# EAGLE design 491 Circuit Schematic to MILL mixed 4th (EAGLE 6.3)
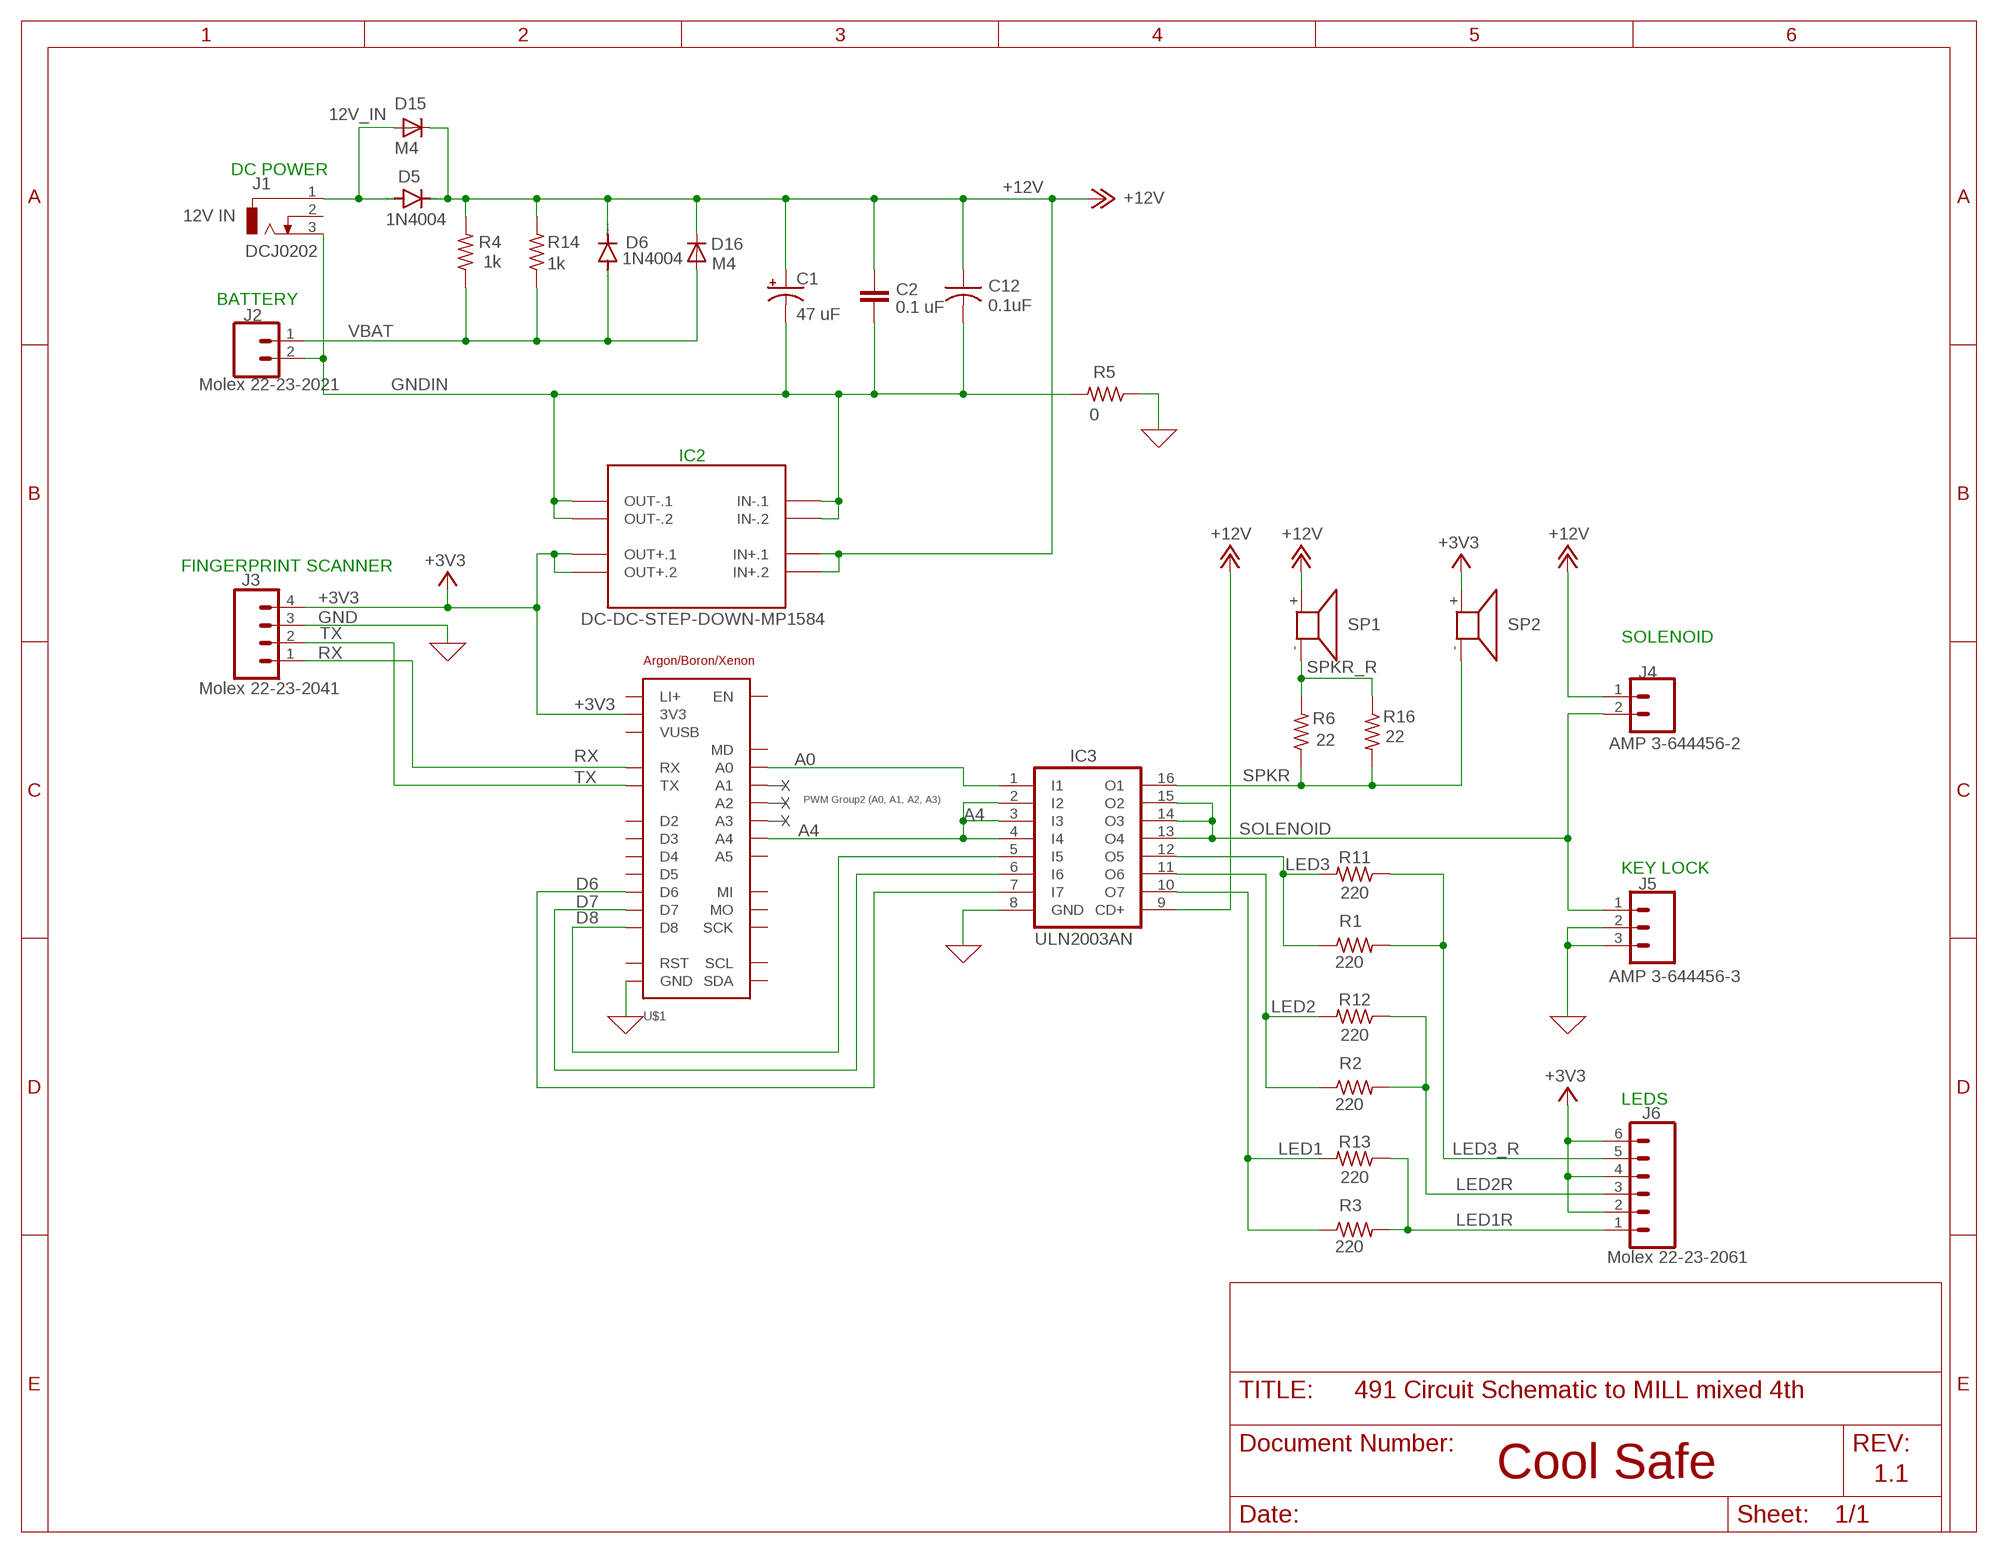
[diagram p0: schematic, sheet 1]

## Parts
C1  47 uF  CPOL-USE2.5-6  [E2,5-6]
C2  0.1 uF  C2.5/5  [C2.5-5]
C12  0.1uF  C-USC1206  [C1206]
D5  1N4004  [DO41-10]
D6  1N4004  [DO41-10]
D15  M4  GF1  [SMA-DO214AC]
D16  M4  GF1  [SMA-DO214AC]
IC2  DC-DC-STEP-DOWN-MP1584  [DC-DC-STEP-DOWN-MP1584]
IC3  ULN2003AN  [DIL16]
J1  DCJ0202  [DCJ0202]
J2  Molex 22-23-2021  CONN_02POLAR  [MOLEX-1X2]
J3  Molex 22-23-2041  CONN_04POLAR  [MOLEX-1X4]
J4  AMP 3-644456-2  CONN_02  [1X02]
J5  AMP 3-644456-3  CONN_03  [1X03]
J6  Molex 22-23-2061  CONN_06POLAR  [MOLEX-1X6]
R1  220  R-US_0207/10  [0207/10]
R2  220  R-US_0207/10  [0207/10]
R3  220  R-US_0207/10  [0207/10]
R4  1k  R-US_0207/10  [0207/10]
R5  0  R-US_0207/10  [0207/10]
R6  22  R-US_0204/7  [0204/7]
R11  220  R-US_M1206  [M1206]
R12  220  R-US_M1206  [M1206]
R13  220  R-US_M1206  [M1206]
R14  1k  R-US_M1206  [M1206]
R16  22  R-US_M1206  [M1206]
SP1  KSS1201  [KSS1201]
SP2  KSS1201  [KSS1201]
U$1  TEMPLATE_ARGON/BORON/XENONPTH  [NO_PADS]

## Nets
12V_IN: D5.A D15.A J1.1
+3V3: IC2.OUT+.1 IC2.OUT+.2 J3.4 J6.2 J6.4 J6.6 SP2.+ U$1.P$14(3V3)
+12V: C1.+ C2.1 C12.1 D5.C D6.C D15.K(C) D16.K(C) IC2.IN+.1 IC2.IN+.2 IC3.9(CD+) J4.1 R4.2 R14.2 SP1.+
A0: IC3.1(I1) U$1.P$17(A0)
A4: IC3.2(I2) IC3.3(I3) IC3.4(I4) U$1.P$21(A4)
D6: IC3.7(I7) U$1.P$6(D6)
D7: IC3.6(I6) U$1.P$5(D7)
D8: IC3.5(I5) U$1.P$4(D8)
GND: IC3.8(GND) J3.3 J5.2 J5.3 R5.1 U$1.P$16(GND)
GNDIN: C1.- C2.2 C12.2 IC2.IN-.1 IC2.IN-.2 IC2.OUT-.1 IC2.OUT-.2 J1.3 J2.2 R5.2
LED1: IC3.10(O7) R3.1 R13.2
LED1R: J6.1 R3.2 R13.1
LED2: IC3.11(O6) R2.1 R12.2
LED2R: J6.3 R2.2 R12.1
LED3: IC3.12(O5) R1.1 R11.2
LED3_R: J6.5 R1.2 R11.1
RX: J3.1 U$1.P$26(RX)
SOLENOID: IC3.13(O4) IC3.14(O3) IC3.15(O2) J4.2 J5.1
SPKR: IC3.16(O1) R6.1 R16.2 SP2.-
SPKR_R: R6.2 R16.1 SP1.-
TX: J3.2 U$1.P$27(TX)
VBAT: D6.A D16.A J2.1 R4.1 R14.1
Unconnected: J1.2 U$1.P$1(LI+) U$1.P$2(EN) U$1.P$3(VUSB) U$1.P$7(D5) U$1.P$8(D4) U$1.P$9(D3) U$1.P$10(D2) U$1.P$11(SCL) U$1.P$12(SDA) U$1.P$13(RST) U$1.P$15(MD) U$1.P$18(A1) U$1.P$19(A2) U$1.P$20(A3) U$1.P$22(A5) U$1.P$23(SCK) U$1.P$24(MO) U$1.P$25(MI)

## Notes on the sheet
- DC POWER
- 12V IN
- BATTERY
- IC2
- FINGERPRINT SCANNER
- SOLENOID
- PWM Group2 (A0, A1, A2, A3)
- KEY LOCK
- LEDS
- Cool Safe | 1.1

## Library data of the parts
C1 = rcl:CPOL-US: POLARIZED CAPACITOR, American symbol; SPICEPREFIX: C
C2 = capacitor-wima:C: CAPACITOR naming: grid - package width
C12 = rcl:C-US: CAPACITOR, American symbol
D5 D6 = diode:1N4004: DIODE general purpose rectifier, 1 A
D15 D16 = diode:GF1: DIODE
IC2 = cool_safe_lib:DC-DC-STEP-DOWN-MP1584: DC/DC Step-Down Regulator based on MP1584 chip MP1584 datasheet available here: http://www.haoyuelectronics.com/Attachment/MP1584/MP1584.pdf Click here to find device on ebay.com <http://www.ebay.com/sch/mp1584+module>
IC3 = uln-udn:ULN2003A: DRIVER ARRAY
J1 = con-jack:DCJ0202: DC POWER JACK Source: DCJ0202.pdf; OC_FARNELL: unknown; OC_NEWARK: unknown
J2 = SparkFun-Connectors:CONN_02: Multi connection point. Often used as Generic Header-pin footprint for 0.1 inch spaced/style header connections On any of the 0.1 inch spaced packages, you can populate with these: Break Away Headers - Straight <https://www.sparkfun.com/products/116> (PRT-00116) Break Away Male Headers - Right Angle <https://www.sparkfun.com/products/553> (PRT-00553) Female Headers <https://www.sparkfun.com/products/115> (PRT-00115) Break Away Headers - Machine Pin <https://www.sparkfun.com/products/117> (PRT-00117) Break Away Female Headers - Swiss Machine Pin <https://www.sparkfun.com/products/743> (PRT-00743) For SCREWTERMINALS and SPRING TERMINALS visit here: Screw Terimnals on SparkFun.com <https://www.sparkfun.com/search/results?term=Screw+Terminals> (5mm/3.5mm/2.54mm spacing) This device is also useful as a general connection point to wire up your design to another part of your project. Our various solder wires solder well into these plated through hole pads. Hook-Up Wire - Assortment (Stranded, 22 AWG) <https://www.sparkfun.com/products/11375> (PRT-11375) Hook-Up Wire - Assortment (Solid Core, 22 AWG) <https://www.sparkfun.com/products/11367> (PRT-11367) View the entire wire category on our website here <https://www.sparkfun.com/categories/141> Special notes: Molex polarized connector foot print use with: PRT-08233 with associated crimp pins and housings. 2.54_SCREWTERM for use with PRT-10571. 3.5mm Screw Terminal footprints for PRT-08084 5mm Screw Terminal footprints for use with PRT-08432; SF_ID: PRT-09918
J3 = SparkFun-Connectors:CONN_04: Multi connection point. Often used as Generic Header-pin footprint for 0.1 inch spaced/style header connections On any of the 0.1 inch spaced packages, you can populate with these: Break Away Headers - Straight <https://www.sparkfun.com/products/116> (PRT-00116) Break Away Male Headers - Right Angle <https://www.sparkfun.com/products/553> (PRT-00553) Female Headers <https://www.sparkfun.com/products/115> (PRT-00115) Break Away Headers - Machine Pin <https://www.sparkfun.com/products/117> (PRT-00117) Break Away Female Headers - Swiss Machine Pin <https://www.sparkfun.com/products/743> (PRT-00743) For SCREWTERMINALS and SPRING TERMINALS visit here: Screw Terimnals on SparkFun.com <https://www.sparkfun.com/search/results?term=Screw+Terminals> (5mm/3.5mm/2.54mm spacing) This device is also useful as a general connection point to wire up your design to another part of your project. Our various solder wires solder well into these plated through hole pads. Hook-Up Wire - Assortment (Stranded, 22 AWG) <https://www.sparkfun.com/products/11375> (PRT-11375) Hook-Up Wire - Assortment (Solid Core, 22 AWG) <https://www.sparkfun.com/products/11367> (PRT-11367) View the entire wire category on our website here <https://www.sparkfun.com/categories/141> Special notes: Molex polarized connector foot print use with SKU : PRT-08231 with associated crimp pins and housings. 1MM SMD Version SKU: PRT-10208; PROD_ID: CONN-08186; SF_ID: PRT-08231
J4 = SparkFun-Connectors:CONN_02: Multi connection point. Often used as Generic Header-pin footprint for 0.1 inch spaced/style header connections On any of the 0.1 inch spaced packages, you can populate with these: Break Away Headers - Straight <https://www.sparkfun.com/products/116> (PRT-00116) Break Away Male Headers - Right Angle <https://www.sparkfun.com/products/553> (PRT-00553) Female Headers <https://www.sparkfun.com/products/115> (PRT-00115) Break Away Headers - Machine Pin <https://www.sparkfun.com/products/117> (PRT-00117) Break Away Female Headers - Swiss Machine Pin <https://www.sparkfun.com/products/743> (PRT-00743) For SCREWTERMINALS and SPRING TERMINALS visit here: Screw Terimnals on SparkFun.com <https://www.sparkfun.com/search/results?term=Screw+Terminals> (5mm/3.5mm/2.54mm spacing) This device is also useful as a general connection point to wire up your design to another part of your project. Our various solder wires solder well into these plated through hole pads. Hook-Up Wire - Assortment (Stranded, 22 AWG) <https://www.sparkfun.com/products/11375> (PRT-11375) Hook-Up Wire - Assortment (Solid Core, 22 AWG) <https://www.sparkfun.com/products/11367> (PRT-11367) View the entire wire category on our website here <https://www.sparkfun.com/categories/141> Special notes: Molex polarized connector foot print use with: PRT-08233 with associated crimp pins and housings. 2.54_SCREWTERM for use with PRT-10571. 3.5mm Screw Terminal footprints for PRT-08084 5mm Screw Terminal footprints for use with PRT-08432
J5 = SparkFun-Connectors:CONN_03: Multi connection point. Often used as Generic Header-pin footprint for 0.1 inch spaced/style header connections On any of the 0.1 inch spaced packages, you can populate with these: Break Away Headers - Straight <https://www.sparkfun.com/products/116> (PRT-00116) Break Away Male Headers - Right Angle <https://www.sparkfun.com/products/553> (PRT-00553) Female Headers <https://www.sparkfun.com/products/115> (PRT-00115) Break Away Headers - Machine Pin <https://www.sparkfun.com/products/117> (PRT-00117) Break Away Female Headers - Swiss Machine Pin <https://www.sparkfun.com/products/743> (PRT-00743) Stackable Header - 3 Pin (Female, 0.1") <https://www.sparkfun.com/products/13875> (PRT-13875) For SCREWTERMINALS and SPRING TERMINALS visit here: Screw Terimnals on SparkFun.com <https://www.sparkfun.com/search/results?term=Screw+Terminals> (5mm/3.5mm/2.54mm spacing) This device is also useful as a general connection point to wire up your design to another part of your project. Our various solder wires solder well into these plated through hole pads. Hook-Up Wire - Assortment (Stranded, 22 AWG) <https://www.sparkfun.com/products/11375> (PRT-11375) Hook-Up Wire - Assortment (Solid Core, 22 AWG) <https://www.sparkfun.com/products/11367> (PRT-11367) View the entire wire category on our website here <https://www.sparkfun.com/categories/141> Special notes: Molex polarized connector foot print use with SKU : PRT-08232 with associated crimp pins and housings.; PROD_ID: XXX-00000; VALUE: 455-1750-1-ND
J6 = SparkFun-Connectors:CONN_06: Multi connection point. Often used as Generic Header-pin footprint for 0.1 inch spaced/style header connections On any of the 0.1 inch spaced packages, you can populate with these: Break Away Headers - Straight <https://www.sparkfun.com/products/116> (PRT-00116) Break Away Male Headers - Right Angle <https://www.sparkfun.com/products/553> (PRT-00553) Female Headers <https://www.sparkfun.com/products/115> (PRT-00115) Break Away Headers - Machine Pin <https://www.sparkfun.com/products/117> (PRT-00117) Break Away Female Headers - Swiss Machine Pin <https://www.sparkfun.com/products/743> (PRT-00743) Arduino Stackable Header - 6 Pin <https://www.sparkfun.com/products/9280> (PRT-09280) For SCREWTERMINALS and SPRING TERMINALS visit here: Screw Terimnals on SparkFun.com <https://www.sparkfun.com/search/results?term=Screw+Terminals> (5mm/3.5mm/2.54mm spacing) This device is also useful as a general connection point to wire up your design to another part of your project. Our various solder wires solder well into these plated through hole pads. Hook-Up Wire - Assortment (Stranded, 22 AWG) <https://www.sparkfun.com/products/11375> (PRT-11375) Hook-Up Wire - Assortment (Solid Core, 22 AWG) <https://www.sparkfun.com/products/11367> (PRT-11367) View the entire wire category on our website here <https://www.sparkfun.com/categories/141>
R1-R6 R11-R14 R16 = rcl:R-US_: RESISTOR, American symbol
SP1 SP2 = buzzer:KSS1201: SPEAKER Source: Schukat; OC_FARNELL: unknown; OC_NEWARK: unknown
U$1 = john:TEMPLATE_ARGON/BORON/XENON

## Board
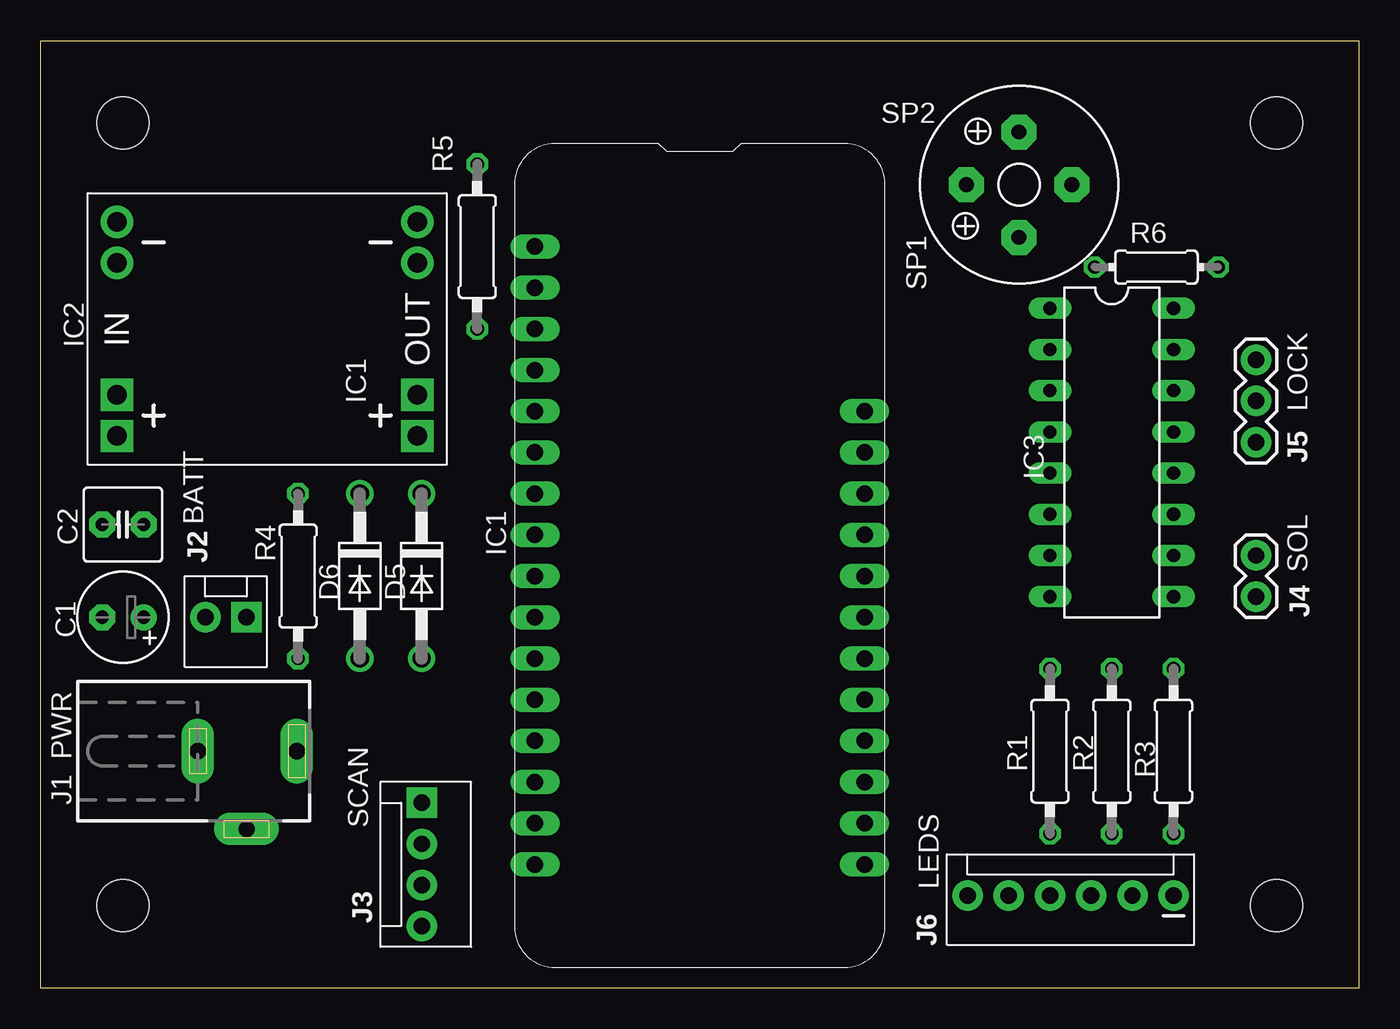
[diagram p1: board, top side]
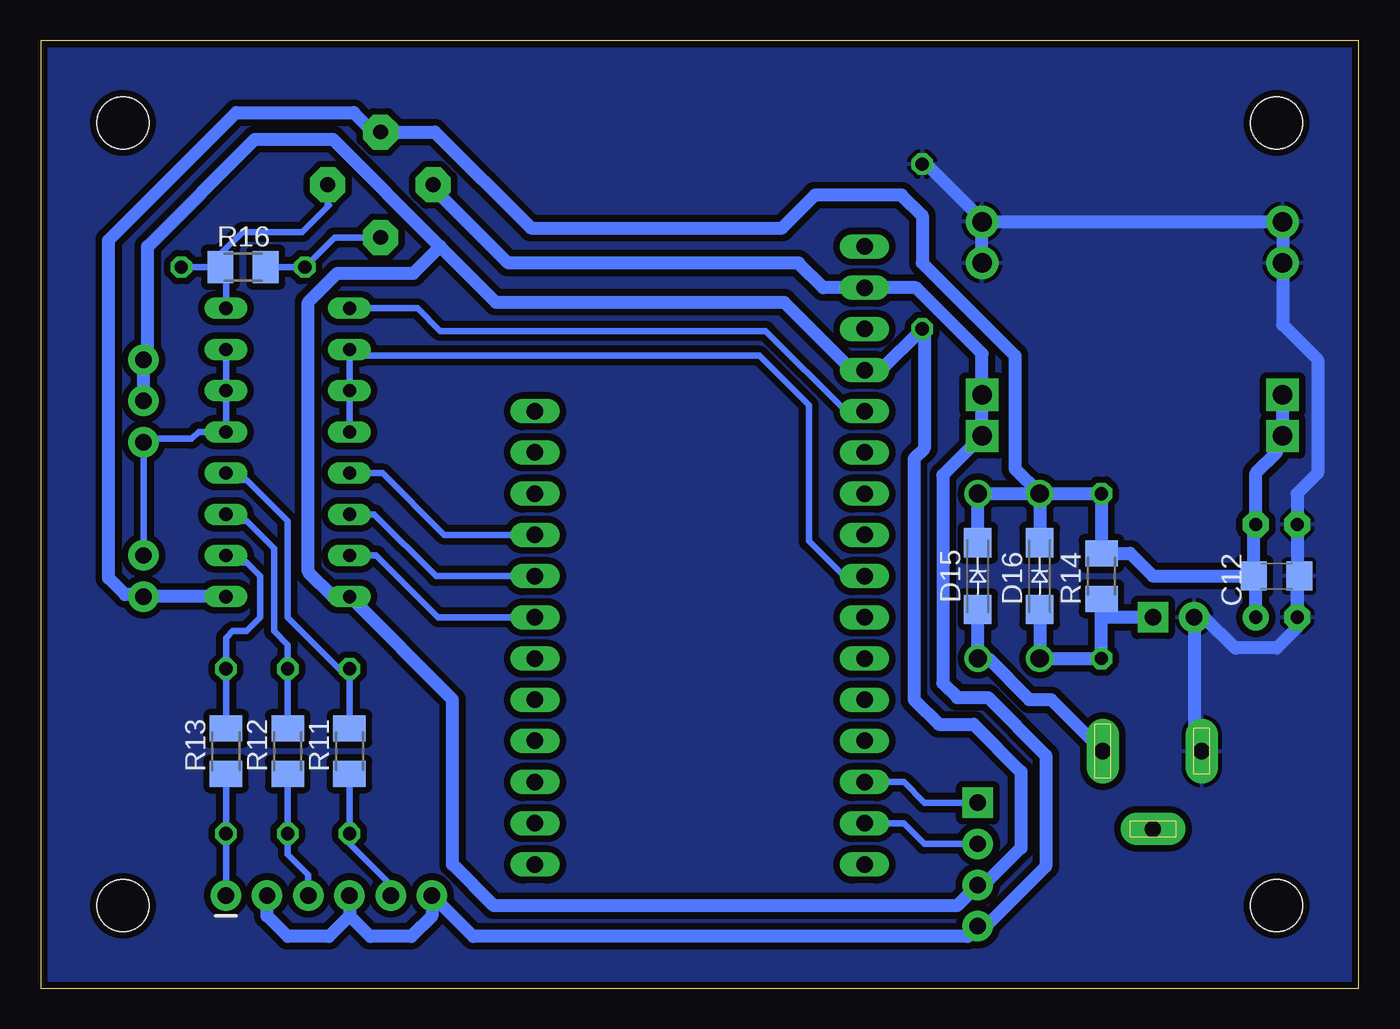
[diagram p2: board, bottom side, seen from below]

Size 81.28 x 58.42 mm. Coordinates in mm from the lower left corner, seen from the top.
Outline: 0,58.42 81.28,58.42 81.28,0 0,0 0,58.42
Copper layers (1*16): Top 0.035mm / dielectric 1.5mm / Bottom 0.035mm
Design rules "BantamJRB": minimum track width 10mil, minimum drill 24mil, track to track 16mil, track to pad 16mil, pad to pad 16mil, via to via 16mil, smd to smd 16mil, copper to edge 16mil, drill to drill 8mil, minimum pad ring 10mil, minimum via ring 8mil, stop-mask expansion 4mil, vias tented up to drill 0mil, thermal gap 10mil
Holes 3.2 mm at 5.08,5.08 5.08,53.34 76.2,53.34 76.2,5.08

### Footprints (pad centres in the part's own frame; a part is rotated, then mirrored left to right if it is on the bottom)
E2,5-6 = drill 0.813 pad 1.6: + -1.27,0 | drill 0.813 pad 1.6 octagon: - 1.27,0
C2.5-5 = drill 0.813 pad 1.6 octagon: 1 -1.27,0; 2 1.27,0
C1206 = smd 1.6 x 1.8: 1 -1.4,0; 2 1.4,0
DO41-10 = drill 1.118: A 5.08,0; C -5.08,0
SMA-DO214AC = smd 1.8 x 1.7: A -2.05,0; K 2.05,0
DC-DC-STEP-DOWN-MP1584 = drill 1.2 pad 2 square: IN+.1 -9.271,-4.064; IN+.2 -9.271,-6.604; OUT+.1 9.271,-4.064; OUT+.2 9.271,-6.604 | drill 1.2 pad 2: IN-.1 -9.271,6.604; IN-.2 -9.271,4.064; OUT-.1 9.271,6.604; OUT-.2 9.271,4.064
DIL16 = drill 0.813 long: 1 -8.89,-3.81; 2 -6.35,-3.81; 3 -3.81,-3.81; 4 -1.27,-3.81; 5 1.27,-3.81; 6 3.81,-3.81; 7 6.35,-3.81; 8 8.89,-3.81; 9 8.89,3.81; 10 6.35,3.81; 11 3.81,3.81; 12 1.27,3.81; 13 -1.27,3.81; 14 -3.81,3.81; 15 -6.35,3.81; 16 -8.89,3.81
DCJ0202 = drill 1 pad 2 long: 1 0,3.1; 2 4.8,0; 3 0,-3
MOLEX-1X2 = drill 1.016 pad 1.88 square: 1 0,0 | drill 1.016 pad 1.88: 2 2.54,0
MOLEX-1X4 = drill 1.016 pad 1.88 square: 1 0,0 | drill 1.016 pad 1.88: 2 2.54,0; 3 5.08,0; 4 7.62,0
1X02 = drill 1.016 pad 1.88: 1 0,0; 2 2.54,0
1X03 = drill 1.016 pad 1.88: 1 0,0; 2 2.54,0; 3 5.08,0
MOLEX-1X6 = drill 1.016 pad 1.88: 1 0,0; 2 2.54,0; 3 5.08,0; 4 7.62,0; 5 10.16,0; 6 12.7,0
0207/10 = drill 0.813 octagon: 1 -5.08,0; 2 5.08,0
0204/7 = drill 0.813 octagon: 1 -3.81,0; 2 3.81,0
M1206 = smd 1.6 x 2: 1 -1.4,0; 2 1.4,0
KSS1201 = drill 0.914 pad 2.159 octagon: + 3.251,0; - -3.251,0
NO_PADS = drill 1.016 long: P$1 -10.16,10.16; P$2 -7.62,10.16; P$3 -5.08,10.16; P$4 -2.54,10.16; P$5 0,10.16; P$6 2.54,10.16; P$7 5.08,10.16; P$8 7.62,10.16; P$9 10.16,10.16; P$10 12.7,10.16; P$11 15.24,10.16; P$12 17.78,10.16; P$13 -20.32,-10.16; P$14 -17.78,-10.16; P$15 -15.24,-10.16; P$16 -12.7,-10.16; P$17 -10.16,-10.16; P$18 -7.62,-10.16; P$19 -5.08,-10.16; P$20 -2.54,-10.16; P$21 0,-10.16; P$22 2.54,-10.16; P$23 5.08,-10.16; P$24 7.62,-10.16; P$25 10.16,-10.16; P$26 12.7,-10.16; P$27 15.24,-10.16; P$28 17.78,-10.16

### Placement (x,y rotation side)
C1  5.08,22.86 180 top
C2  5.08,28.57 180 top
C12  5.08,25.4 0 bottom
D5  23.5,25.4 270 top
D6  19.68,25.4 270 top
D15  23.5,25.4 90 bottom
D16  19.68,25.4 90 bottom
IC2  13.97,40.64 0 top
IC3  66.04,33.02 270 top
J1  12.7,14.61 270 top
J2  12.7,22.86 180 top
J3  23.5,11.43 270 top
J4  74.93,24.13 90 top
J5  74.93,33.66 90 top
J6  69.85,5.71 180 top
R1  62.23,14.61 270 top
R2  66.04,14.61 270 top
R3  69.85,14.61 270 top
R4  15.88,25.4 90 top
R5  26.92,45.72 90 top
R6  68.79,44.45 180 top
R11  62.23,14.61 90 bottom
R12  66.04,14.61 90 bottom
R13  69.85,14.61 90 bottom
R14  15.88,25.4 90 bottom
R16  68.79,44.45 180 bottom
SP1  60.33,49.53 90 top
SP2  60.33,49.53 180 top
U$1  40.64,25.4 270 top

### Tracks (layer width: path | path; a pad name or v marks a point on that pad's centre or on a via)
12V_IN
  Bottom 0.813: D15.A D5.A 22.86,20.32 20.32,17.78 18.98,17.78 J1.1
+3V3
  Bottom 0.813: 62.23,4.45 60.96,3.17 58.42,3.17 57.15,4.45 J6.6 54.61,3.17 24.13,3.17 J3.4 22.99,3.81 19.3,7.49 19.3,14.35 22.86,17.91 24.77,17.91 25.65,18.8 25.65,31.62 IC2.OUT+.2 IC2.OUT+.1 23.24,39.12 27.3,43.18 U$1.P$14 33.02,43.18 34.54,44.7 52.45,44.7 57.07,49.33 SP2.+ | J6.4 62.23,4.45 | 62.23,4.45 63.5,3.17 66.04,3.17 67.31,4.45 J6.2
+12V
  Bottom 0.813: D15.K D5.C D6.C | D6.C D16.K | D6.C R4.2 R14.2 14.1,26.8 12.7,25.4 C12.1 | C1.+ 6.35,25.27 C12.1 | C12.1 6.48,28.45 C2.1 6.35,31.75 5.08,33.02 5.08,33.66 IC2.IN+.2 IC2.IN+.1 | J4.1 IC3.9 75.06,24.13 75.18,24.26 76.07,24.26 77.09,25.27 77.09,46.1 69.22,53.98 61.98,53.98 60.78,52.78 SP1.+ 56.97,52.78 51.05,46.86 35.56,46.86 33.53,48.9 28.19,48.9 26.92,47.62 26.92,44.7 21.21,38.99 21.21,32 D6.C
A0
  Bottom 0.406: IC3.1 58.04,41.91 56.64,40.51 36.58,40.51 31.62,35.56 U$1.P$17
A4
  Bottom 0.406: IC3.4 IC3.3 IC3.2 61.85,38.99 36.96,38.99 33.91,35.94 33.91,27.56 31.75,25.4 U$1.P$21
D6
  Bottom 0.406: IC3.7 60.58,26.67 56.77,22.86 U$1.P$6
D7
  Bottom 0.406: IC3.6 60.71,29.21 56.9,25.4 U$1.P$5
D8
  Bottom 0.406: IC3.5 60.2,31.75 56.39,27.94 U$1.P$4
GND
  Bottom 0.813: J5.3 J5.2 74.93,38.48 74.68,38.73 74.68,45.72 68.07,52.32 63.25,52.32 56.64,45.72 | 56.64,45.72 53.21,42.29 35.43,42.29 31.24,38.1 U$1.P$16 29.46,38.1 R5.1 | 56.64,45.72 58.29,44.07 62.99,44.07 64.77,42.29 64.77,25.65 63.25,24.13 IC3.8 55.88,17.78 55.88,7.62 53.34,5.08 24.77,5.08 J3.3
GNDIN
  Bottom 0.813: IC2.OUT-.1 IC2.IN-.1 IC2.IN-.2 4.7,40.89 2.54,38.73 2.54,31.75 3.81,30.48 C2.2 C1.- | C1.- 3.81,22.23 5.08,20.95 7.62,20.95 9.53,22.86 J2.2 10.16,15.06 J1.3 | C1.- 3.81,25.27 C12.2 | IC2.OUT-.2 IC2.OUT-.1 | IC2.OUT-.1 23.24,47.37 26.67,50.8 R5.2
  pour Bottom (isolate 0.01, rank 6): 0,0 0,58.42 81.28,58.42 81.28,0
LED1
  Bottom 0.406: 67.73,25.4 67.73,22.86 68.58,22.01 69.43,22.01 69.85,21.59 R3.1 R13.2 | 67.73,25.4 | 67.73,25.4 68.58,26.25 69.43,26.25 IC3.10
LED1R
  Bottom 0.406: J6.1 R3.2 R13.1
LED2
  Bottom 0.406: IC3.11 69.43,28.79 68.58,28.79 66.89,27.09 66.89,22.01 66.04,21.17 R2.1 R12.2
LED2R
  Bottom 0.406: J6.3 64.77,6.99 66.04,8.26 R2.2 R12.1
LED3
  Bottom 0.406: IC3.12 69.43,31.33 68.58,31.33 66.04,28.79 66.04,22.86 62.87,19.68 R1.1 R11.2
LED3_R
  Bottom 0.406: J6.5 59.69,6.35 62.23,8.89 R1.2 R11.1
N$1
  Bottom 0.813: 23.11,6.35 20.83,8.64 20.83,13.34 23.75,16.26 25.91,16.26 27.43,17.78 27.43,32.64 26.8,33.27 26.8,40.64
RX
  Bottom 0.406: J3.1 26.8,11.43 28.07,12.7 U$1.P$26
SOLENOID
  Bottom 0.406: IC3.15 IC3.14 IC3.13 71.54,34.29 71.97,33.87 74.72,33.87 J5.1 J4.2
SPKR
  Bottom 0.406: IC3.16 69.85,44.11 R16.2 | R16.2 R6.1 | SP2.- 63.58,48.34 63.5,48.26 65.15,46.61 68.83,46.61 70.1,45.34 70.1,44.54 R16.2
SPKR_R
  Bottom 0.406: SP1.- 63.15,46.28 R6.2 R16.1
TX
  Bottom 0.406: J3.2 26.8,8.89 28.07,10.16 U$1.P$27
VBAT
  Bottom 0.813: D16.A D6.A R4.1 15.88,22.86 | 15.88,22.86 R14.1 | J2.1 15.88,22.86

### Text on the board
tNames: IC2 | IC1 | LOCK | BATT | IC1 | SOL | PWR | SCAN | LEDS